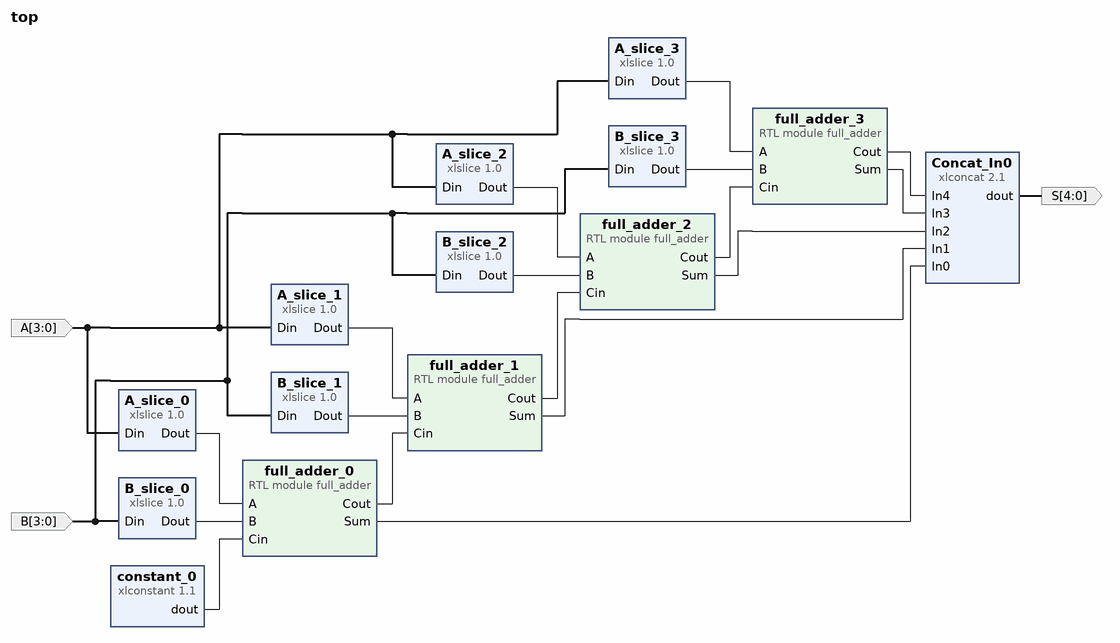
[diagram p0: block diagram of the top level]
# Vivado block design top, xc7a100tcsg324-1, Vivado 2025.1
create_bd_design top

create_bd_port -dir I -from 3 -to 0 A
create_bd_port -dir I -from 3 -to 0 B
create_bd_port -dir O -from 4 -to 0 S

create_bd_cell -type module -reference full_adder full_adder_0
create_bd_cell -type module -reference full_adder full_adder_1
create_bd_cell -type module -reference full_adder full_adder_2
create_bd_cell -type module -reference full_adder full_adder_3
create_bd_cell -type ip -vlnv xilinx.com:ip:xlslice:1.0 A_slice_0
set_property -dict {CONFIG.DIN_WIDTH 4} [get_bd_cells A_slice_0]
create_bd_cell -type ip -vlnv xilinx.com:ip:xlslice:1.0 A_slice_1
set_property -dict {CONFIG.DIN_FROM 1 CONFIG.DIN_TO 1 CONFIG.DIN_WIDTH 4} [get_bd_cells A_slice_1]
create_bd_cell -type ip -vlnv xilinx.com:ip:xlslice:1.0 A_slice_2
set_property -dict {CONFIG.DIN_FROM 2 CONFIG.DIN_TO 2 CONFIG.DIN_WIDTH 4} [get_bd_cells A_slice_2]
create_bd_cell -type ip -vlnv xilinx.com:ip:xlslice:1.0 A_slice_3
set_property -dict {CONFIG.DIN_FROM 3 CONFIG.DIN_TO 3 CONFIG.DIN_WIDTH 4} [get_bd_cells A_slice_3]
create_bd_cell -type ip -vlnv xilinx.com:ip:xlslice:1.0 B_slice_0
set_property -dict {CONFIG.DIN_WIDTH 4} [get_bd_cells B_slice_0]
create_bd_cell -type ip -vlnv xilinx.com:ip:xlslice:1.0 B_slice_1
set_property -dict {CONFIG.DIN_FROM 1 CONFIG.DIN_TO 1 CONFIG.DIN_WIDTH 4} [get_bd_cells B_slice_1]
create_bd_cell -type ip -vlnv xilinx.com:ip:xlslice:1.0 B_slice_2
set_property -dict {CONFIG.DIN_FROM 2 CONFIG.DIN_TO 2 CONFIG.DIN_WIDTH 4} [get_bd_cells B_slice_2]
create_bd_cell -type ip -vlnv xilinx.com:ip:xlslice:1.0 B_slice_3
set_property -dict {CONFIG.DIN_FROM 3 CONFIG.DIN_TO 3 CONFIG.DIN_WIDTH 4} [get_bd_cells B_slice_3]
create_bd_cell -type ip -vlnv xilinx.com:ip:xlconstant:1.1 constant_0
set_property -dict {CONFIG.CONST_VAL 0} [get_bd_cells constant_0]
create_bd_cell -type ip -vlnv xilinx.com:ip:xlconcat:2.1 Concat_In0
set_property -dict {CONFIG.NUM_PORTS 5} [get_bd_cells Concat_In0]

# ---- connections ----

connect_bd_net -net A0_1 [get_bd_ports A] \
  [get_bd_pins A_slice_0/Din] [get_bd_pins A_slice_3/Din] [get_bd_pins A_slice_1/Din] [get_bd_pins A_slice_2/Din]
connect_bd_net [get_bd_pins A_slice_0/Dout] [get_bd_pins full_adder_0/A]
connect_bd_net [get_bd_pins A_slice_1/Dout] [get_bd_pins full_adder_1/A]
connect_bd_net [get_bd_pins A_slice_2/Dout] [get_bd_pins full_adder_2/A]
connect_bd_net [get_bd_pins A_slice_3/Dout] [get_bd_pins full_adder_3/A]
connect_bd_net -net B0_1 [get_bd_ports B] \
  [get_bd_pins B_slice_0/Din] [get_bd_pins B_slice_1/Din] [get_bd_pins B_slice_2/Din] [get_bd_pins B_slice_3/Din]
connect_bd_net [get_bd_pins B_slice_0/Dout] [get_bd_pins full_adder_0/B]
connect_bd_net [get_bd_pins B_slice_1/Dout] [get_bd_pins full_adder_1/B]
connect_bd_net [get_bd_pins B_slice_2/Dout] [get_bd_pins full_adder_2/B]
connect_bd_net [get_bd_pins B_slice_3/Dout] [get_bd_pins full_adder_3/B]
connect_bd_net [get_bd_pins Concat_In0/dout] [get_bd_ports S]
connect_bd_net [get_bd_pins full_adder_0/Cout] [get_bd_pins full_adder_1/Cin]
connect_bd_net [get_bd_pins full_adder_0/Sum] [get_bd_pins Concat_In0/In0]
connect_bd_net [get_bd_pins full_adder_1/Cout] [get_bd_pins full_adder_2/Cin]
connect_bd_net [get_bd_pins full_adder_1/Sum] [get_bd_pins Concat_In0/In1]
connect_bd_net [get_bd_pins full_adder_2/Cout] [get_bd_pins full_adder_3/Cin]
connect_bd_net [get_bd_pins full_adder_2/Sum] [get_bd_pins Concat_In0/In2]
connect_bd_net [get_bd_pins full_adder_3/Cout] [get_bd_pins Concat_In0/In4]
connect_bd_net [get_bd_pins full_adder_3/Sum] [get_bd_pins Concat_In0/In3]
connect_bd_net -net xlconstant_0_dout [get_bd_pins constant_0/dout] [get_bd_pins full_adder_0/Cin]

validate_bd_design
save_bd_design
